# Altium project ExtPlate.PrjPCB
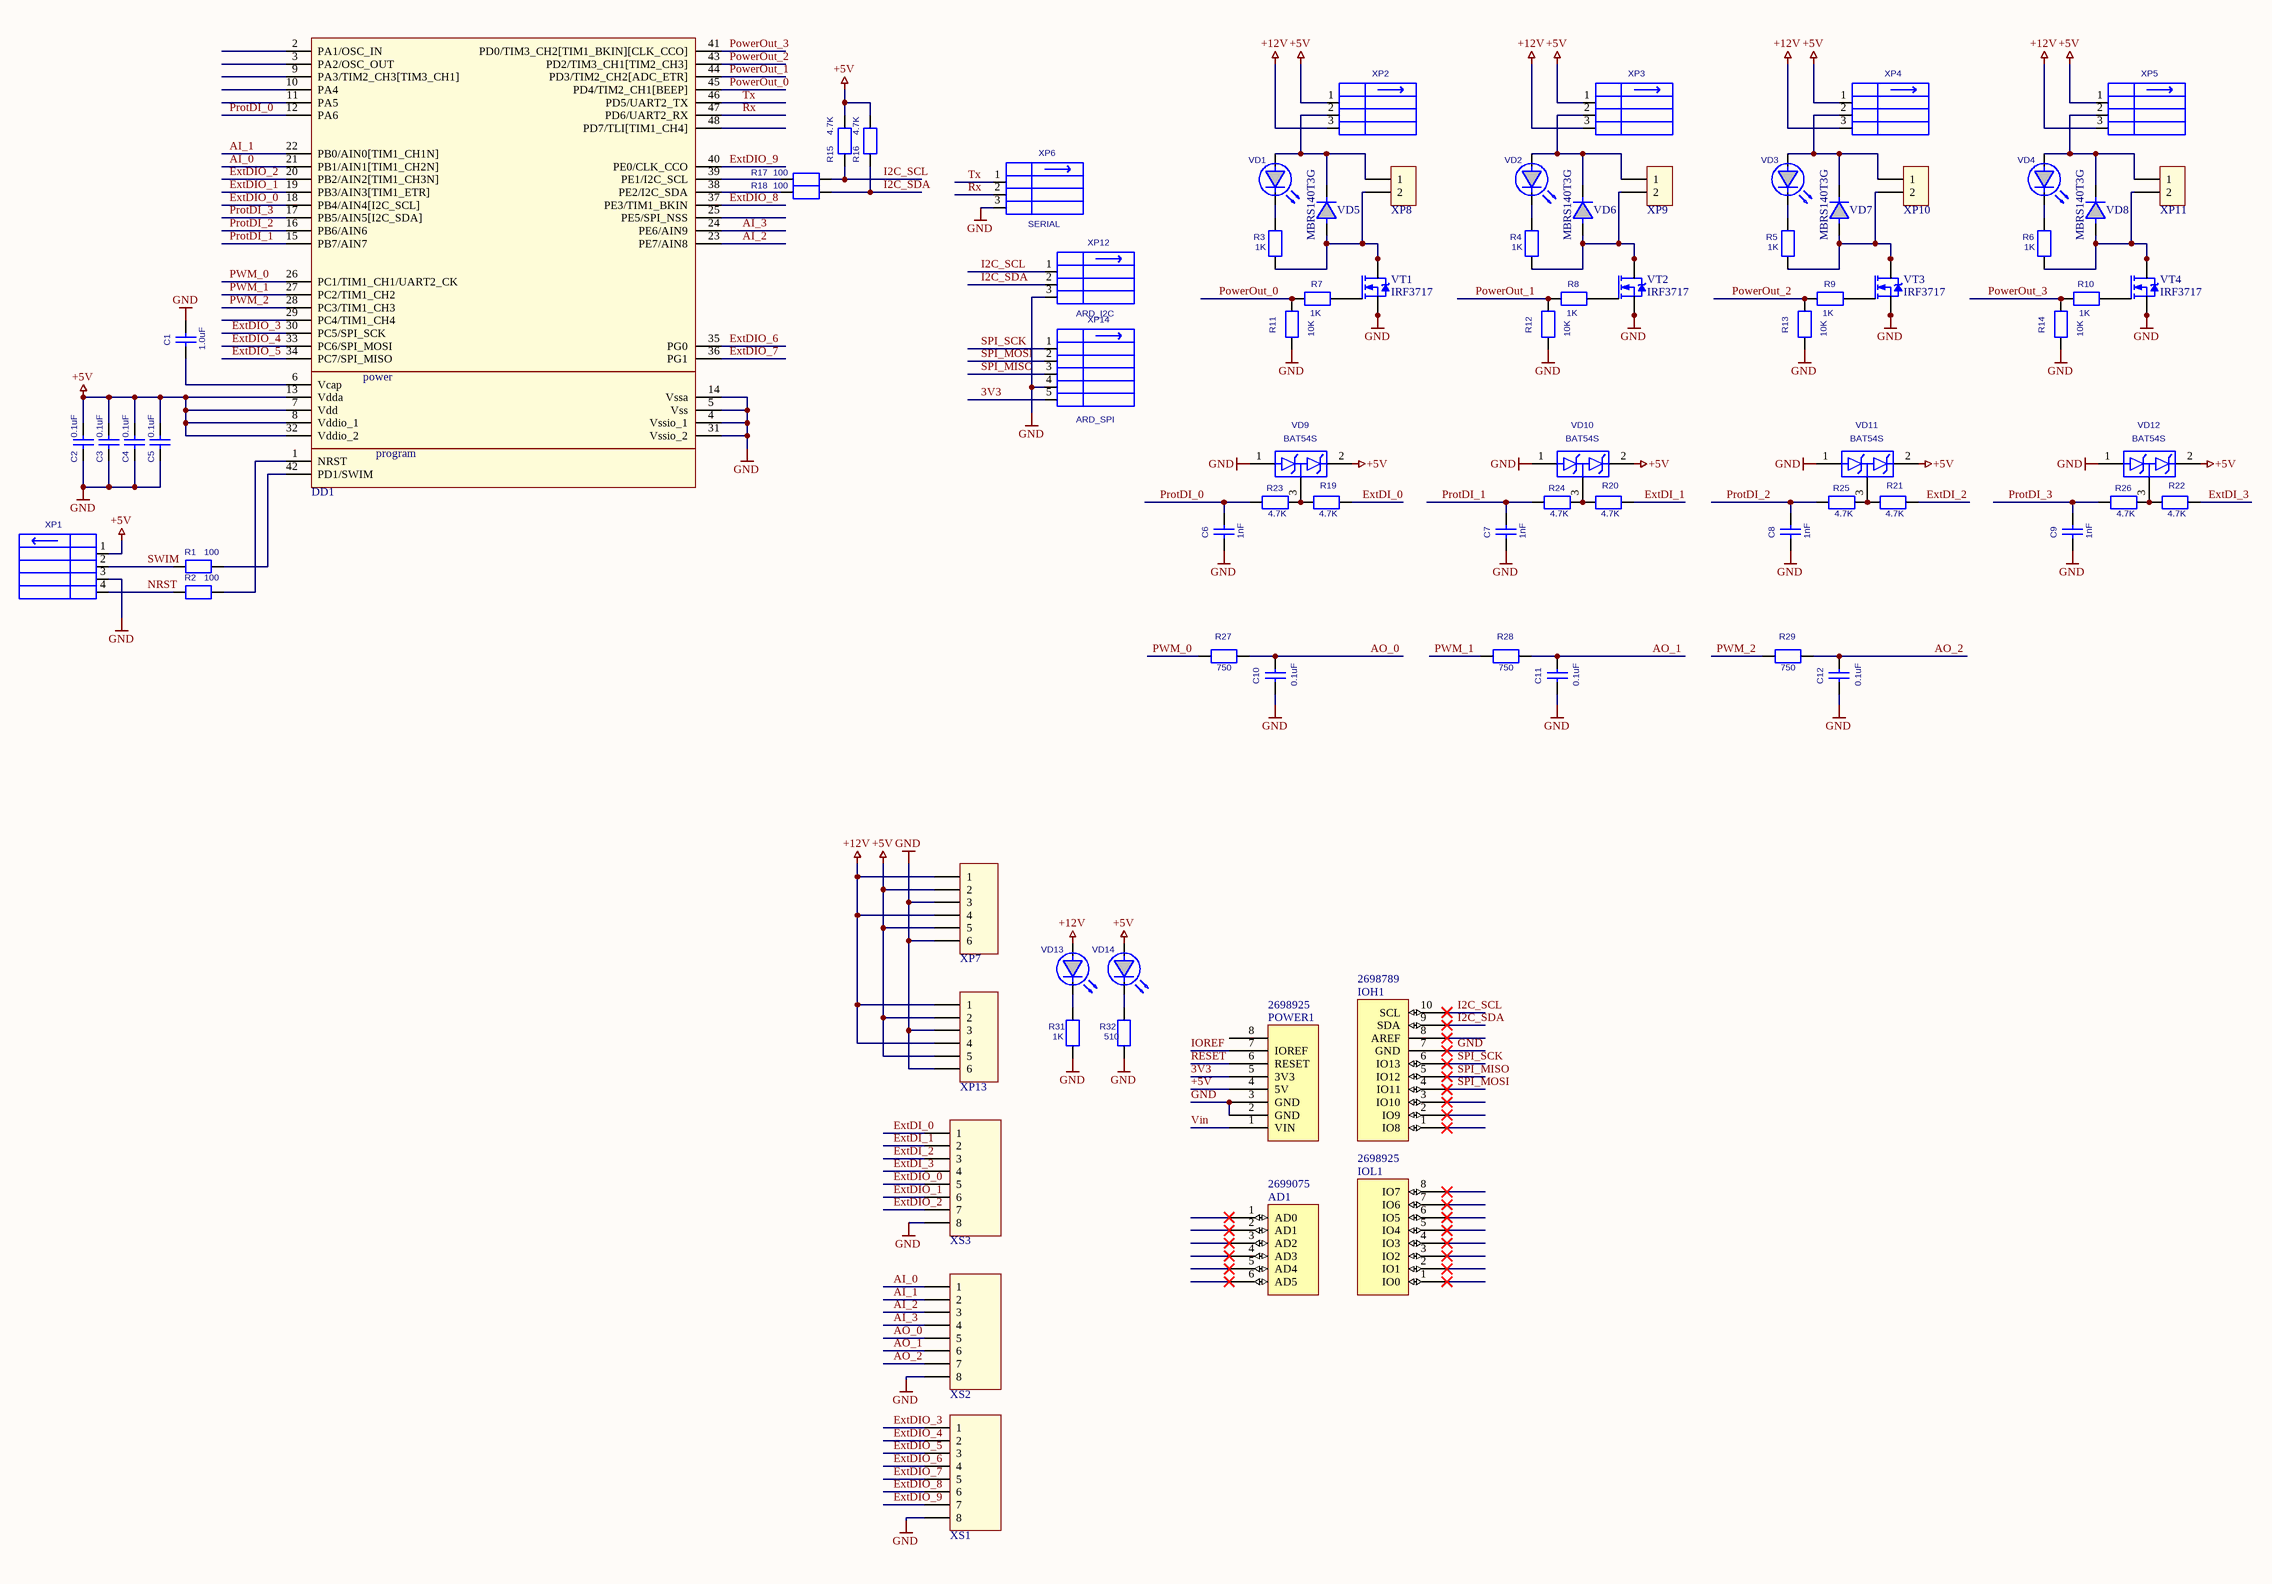
[diagram p0: ExtPlateSheet1.SchDoc]
1 sheet, 83 parts. Net scope: global (net labels, ports and power ports of the same name join across sheets).
Board file: ExtPlatePCB1.PcbDoc

## Sheet ExtPlateSheet1.SchDoc
size A2; Scale: {Масш.}; Title1str: {Наименование}; PageSetup: Record=PageOptions|CenterHorizontal=False|CenterVertical=False|PrintScale=0.95|XCorrection=0.00|YCorrection=0.00|PrintKind=1|BorderSize=5000000|LeftOffset=0|BottomOffset=0|Orientation=1|PaperLength=1000|PaperWidth=1000|Scale=100|PaperSource=15|PrintQuality=600|MediaType=1|DitherType=10|PaperKind=A4|PrintScaleMode=1; Title2str: {Наименование}; ProcessInspection: {Т.контр.}; Mass: {Масса}; NormInspection: {Н.контр.}; EngineerName: {Инженер}; Letter1Column: {}; Letter2Column: {}; Letter3Column: {}; DocumentType: {Документ}; DocumentType1str: {Документ}; DocumentType2str: {Документ}; Organization: Altium Limited; Address1: 3 Minna Close; Address2: Belrose; Address3: NSW 2085; Address4: Australia

### Parts
AD1  Supplier Part Number 4: 2699075  [PLS6]  (hidden comment: AD)
C1  1.0uF  [C-1608[0603]]
C2  0.1uF  [C-1608[0603]]
C3  0.1uF  [C-1608[0603]]
C4  0.1uF  [C-1608[0603]]
C5  0.1uF  [C-1608[0603]]
C6  1nF  [C-1608[0603]]
C7  1nF  [C-1608[0603]]
C8  1nF  [C-1608[0603]]
C9  1nF  [C-1608[0603]]
C10  0.1uF  [C-1608[0603]]
C11  0.1uF  [C-1608[0603]]
C12  0.1uF  [C-1608[0603]]
DD1  STM8S105Cx  [LQFP48_N]  (value not drawn)
IOH1  Supplier Part Number 3: 2698789  [PLS10]  (hidden comment: IOH)
IOL1  Supplier Part Number 4: 2698925  [PLS8]  (hidden comment: IOL)
POWER1  Supplier Part Number 4: 2698925  [PLS8]  (hidden comment: POWER_UNO)
R1  100  [R-1608[0603]]
R2  100  [R-1608[0603]]
R3  1K  [R-1608[0603]]
R4  1K  [R-1608[0603]]
R5  1K  [R-1608[0603]]
R6  1K  [R-1608[0603]]
R7  1K  [R-1608[0603]]
R8  1K  [R-1608[0603]]
R9  1K  [R-1608[0603]]
R10  1K  [R-1608[0603]]
R11  10K  [R-1608[0603]]
R12  10K  [R-1608[0603]]
R13  10K  [R-1608[0603]]
R14  10K  [R-1608[0603]]
R15  4.7K  [R-1608[0603]]
R16  4.7K  [R-1608[0603]]
R17  100  [R-1608[0603]]
R18  100  [R-1608[0603]]
R19  4.7K  [R-1608[0603]]
R20  4.7K  [R-1608[0603]]
R21  4.7K  [R-1608[0603]]
R22  4.7K  [R-1608[0603]]
R23  4.7K  [R-1608[0603]]
R24  4.7K  [R-1608[0603]]
R25  4.7K  [R-1608[0603]]
R26  4.7K  [R-1608[0603]]
R27  750  [R-1608[0603]]
R28  750  [R-1608[0603]]
R29  750  [R-1608[0603]]
R31  1K  [R-1608[0603]]
R32  510  [R-1608[0603]]
VD1  KB170G  [LED-2012[0805]]  (value not drawn)
VD2  KB170G  [LED-2012[0805]]  (value not drawn)
VD3  KB170G  [LED-2012[0805]]  (value not drawn)
VD4  KB170G  [LED-2012[0805]]  (value not drawn)
VD5  MBRS140T3G  [SMB]
VD6  MBRS140T3G  [SMB]
VD7  MBRS140T3G  [SMB]
VD8  MBRS140T3G  [SMB]
VD9  BAT54S  [SOT-23]
VD10  BAT54S  [SOT-23]
VD11  BAT54S  [SOT-23]
VD12  BAT54S  [SOT-23]
VD13  KB170G  [LED-2012[0805]]  (value not drawn)
VD14  KB170G  [LED-2012[0805]]  (value not drawn)
VT1  IRF3717  [SO8]
VT2  IRF3717  [SO8]
VT3  IRF3717  [SO8]
VT4  IRF3717  [SO8]
XP1  PLS-4  [PLS4]  (value not drawn)
XP2  PLS-3  [PLS3]  (value not drawn)
XP3  PLS-3  [PLS3]  (value not drawn)
XP4  PLS-3  [PLS3]  (value not drawn)
XP5  PLS-3  [PLS3]  (value not drawn)
XP6  value SERIAL  [PLS3]  (hidden comment: PLS-3)
XP7  MF-6M  [MF-6M]  (value not drawn)
XP8  2EDGR-5.08  [2EDGR-5.08]  (value not drawn)
XP9  2EDGR-5.08  [2EDGR-5.08]  (value not drawn)
XP10  2EDGR-5.08  [2EDGR-5.08]  (value not drawn)
XP11  2EDGR-5.08  [2EDGR-5.08]  (value not drawn)
XP12  value ARD_I2C  [PLS3]  (hidden comment: PLS-3)
XP13  MF-6M  [MF-6M]  (value not drawn)
XP14  value ARD_SPI  [PLS5]  (hidden comment: PLS-5)
XS1  5555164-1  [RJ45 8pin]  (value not drawn)
XS2  5555164-1  [RJ45 8pin]  (value not drawn)
XS3  5555164-1  [RJ45 8pin]  (value not drawn)

### Nets
+5V: C2.1 C3.1 C4.1 C5.1 DD1.7(Vdd) DD1.8(Vddio_1) DD1.13(Vdda) DD1.32(Vddio_2) POWER1.4(5V) R15.2 R16.2 VD9.2(c) VD10.2(c) VD11.2(c) VD12.2(c) VD14.2(A) XP1.1 XP2.1 XP3.1 XP4.1 XP5.1 XP7.2 XP7.5 XP13.2 XP13.5
+12V: VD13.2(A) XP2.3 XP3.3 XP4.3 XP5.3 XP7.1 XP7.4 XP13.1 XP13.4
GND: C1.1 C2.2 C3.2 C4.2 C5.2 C6.2 C7.2 C8.2 C9.2 C10.2 C11.2 C12.2 DD1.4(Vssio_1) DD1.5(Vss) DD1.14(Vssa) DD1.31(Vssio_2) IOH1.7(GND) POWER1.2(GND) POWER1.3(GND) R11.1 R12.1 R13.1 R14.1 R31.2 R32.2 VD9.1(a) VD10.1(a) VD11.1(a) VD12.1(a) VT1.1 VT1.2 VT1.3 VT2.1 VT2.2 VT2.3 VT3.1 VT3.2 VT3.3 VT4.1 VT4.2 VT4.3 XP1.3 XP6.3 XP7.3 XP7.6 XP12.3 XP13.3 XP13.6 XP14.4 XS1.8 XS2.8 XS3.8
3V3: POWER1.5(3V3) XP14.5
AI_0: DD1.21(PB1/AIN1[TIM1_CH2N]) XS2.1
AI_1: DD1.22(PB0/AIN0[TIM1_CH1N]) XS2.2
AI_2: DD1.23(PE7/AIN8) XS2.3
AI_3: DD1.24(PE6/AIN9) XS2.4
AO_0: C10.1 R27.2 XS2.5
AO_1: C11.1 R28.2 XS2.6
AO_2: C12.1 R29.2 XS2.7
ExtDI_0: R19.2 XS3.1
ExtDI_1: R20.2 XS3.2
ExtDI_2: R21.2 XS3.3
ExtDI_3: R22.2 XS3.4
ExtDIO_0: DD1.18(PB4/AIN4[I2C_SCL]) XS3.5
ExtDIO_1: DD1.19(PB3/AIN3[TIM1_ETR]) XS3.6
ExtDIO_2: DD1.20(PB2/AIN2[TIM1_CH3N]) XS3.7
ExtDIO_3: DD1.30(PC5/SPI_SCK) XS1.1
ExtDIO_4: DD1.33(PC6/SPI_MOSI) XS1.2
ExtDIO_5: DD1.34(PC7/SPI_MISO) XS1.3
ExtDIO_6: DD1.35(PG0) XS1.4
ExtDIO_7: DD1.36(PG1) XS1.5
ExtDIO_8: DD1.37(PE3/TIM1_BKIN) XS1.6
ExtDIO_9: DD1.40(PE0/CLK_CCO) XS1.7
I2C_SCL: IOH1.10(SCL) R15.1 R17.2 XP12.1
I2C_SDA: IOH1.9(SDA) R16.1 R18.2 XP12.2
IOREF: POWER1.7(IOREF)
NRST: R2.1 XP1.4
PowerOut_0: DD1.45(PD4/TIM2_CH1[BEEP]) R7.2 R11.2
PowerOut_1: DD1.44(PD3/TIM2_CH2[ADC_ETR]) R8.2 R12.2
PowerOut_2: DD1.43(PD2/TIM3_CH1[TIM2_CH3]) R9.2 R13.2
PowerOut_3: DD1.41(PD0/TIM3_CH2[TIM1_BKIN][CLK_CCO]) R10.2 R14.2
ProtDI_0: C6.1 DD1.12(PA6) R23.1
ProtDI_1: C7.1 DD1.15(PB7/AIN7) R24.1
ProtDI_2: C8.1 DD1.16(PB6/AIN6) R25.1
ProtDI_3: C9.1 DD1.17(PB5/AIN5[I2C_SDA]) R26.1
PWM_0: DD1.26(PC1/TIM1_CH1/UART2_CK) R27.1
PWM_1: DD1.27(PC2/TIM1_CH2) R28.1
PWM_2: DD1.28(PC3/TIM1_CH3) R29.1
RESET: POWER1.6(RESET)
Rx: DD1.47(PD6/UART2_RX) XP6.2
SPI_MISO: IOH1.5(IO12) XP14.3
SPI_MOSI: IOH1.4(IO11) XP14.2
SPI_SCK: IOH1.6(IO13) XP14.1
SWIM: R1.1 XP1.2
Tx: DD1.46(PD5/UART2_TX) XP6.1
Vin: POWER1.1(VIN)
NetC1_2: C1.2 DD1.6(Vcap)
NetDD1_1: DD1.1(NRST) R2.2
NetDD1_38: DD1.38(PE2/I2C_SDA) R18.1
NetDD1_39: DD1.39(PE1/I2C_SCL) R17.1
NetDD1_42: DD1.42(PD1/SWIM) R1.2
NetR3_1: R3.1 VD1.1(K)
NetR3_2: R3.2 VD5.2(A) VT1.5 VT1.6 VT1.7 VT1.8 XP8.2
NetR4_1: R4.1 VD2.1(K)
NetR4_2: R4.2 VD6.2(A) VT2.5 VT2.6 VT2.7 VT2.8 XP9.2
NetR5_1: R5.1 VD3.1(K)
NetR5_2: R5.2 VD7.2(A) VT3.5 VT3.6 VT3.7 VT3.8 XP10.2
NetR6_1: R6.1 VD4.1(K)
NetR6_2: R6.2 VD8.2(A) VT4.5 VT4.6 VT4.7 VT4.8 XP11.2
NetR7_1: R7.1 VT1.4
NetR8_1: R8.1 VT2.4
NetR9_1: R9.1 VT3.4
NetR10_1: R10.1 VT4.4
NetR19_1: R19.1 R23.2 VD9.3(ka)
NetR20_1: R20.1 R24.2 VD10.3(ka)
NetR21_1: R21.1 R25.2 VD11.3(ka)
NetR22_1: R22.1 R26.2 VD12.3(ka)
NetR31_1: R31.1 VD13.1(K)
NetR32_1: R32.1 VD14.1(K)
NetVD1_2: VD1.2(A) VD5.1(K) XP2.2 XP8.1
NetVD2_2: VD2.2(A) VD6.1(K) XP3.2 XP9.1
NetVD3_2: VD3.2(A) VD7.1(K) XP4.2 XP10.1
NetVD4_2: VD4.2(A) VD8.1(K) XP5.2 XP11.1

Not connected (* = marked no-connect by the designer): AD1 1(AD0)* 2(AD1)* 3(AD2)* 4(AD3)* 5(AD4)* 6(AD5)*; DD1 2(PA1/OSC_IN) 3(PA2/OSC_OUT) 9(PA3/TIM2_CH3[TIM3_CH1]) 10(PA4) 11(PA5) 25(PE5/SPI_NSS) 29(PC4/TIM1_CH4) 48(PD7/TLI[TIM1_CH4]); IOH1 1(IO8)* 2(IO9)* 3(IO10)* 8(AREF)*; IOL1 1(IO0)* 2(IO1)* 3(IO2)* 4(IO3)* 5(IO4)* 6(IO5)* 7(IO6)* 8(IO7)*; POWER1 8

### Notes on the sheet
- Title
- Size:
- Date:
- File:
- A0
- Number:
- Time:
- Revision:
- Sheet
- of
- (in symbol STM8S105C) power; program

### Library data of the parts
C1-C12 = C-0603: Value: *
DD1 = STM8S105C: Access line, 16 MHz STM8S 8-bit MCU
R1-R29 R31 R32 = R-0603: Value: *
VD1-VD4 VD13 VD14 = KB170G: Green Led 0805; Value: {Value}
VD5-VD8 = MBRS140T3G: Surface Mount Schottky Power Rectifier
VD9-VD12 = BAT54S: Schottky barrier (double) diodes
XP1 = PLS-4: Value: {Value}
XP2-XP5 = PLS-3: Value: {Value}
XP7 XP13 = MF-6M: Mini-Fit 6 pin Connector on board.
XS1-XS3 = 5555164-1: PCB Mounted Jacks - Single Port, Multi-port and Stacked
AD1 = AD: Supplier 1: Arrow; Supplier Part Number 1: 2699089; Supplier 2: Digi-Key; Supplier Part Number 2: SAM1198-06-ND; Supplier 3: Arrow; Supplier Part Number 3: 2699088; Supplier 4: Arrow
IOH1 = IOH: Supplier 1: Arrow; Supplier Part Number 1: 2698803S4475693N1004; Supplier 2: Digi-Key; Supplier Part Number 2: SAM1198-10-ND; Supplier 3: Arrow
IOL1 = IOL: Supplier 1: Digi-Key; Supplier Part Number 1: SAM1198-08-ND; Supplier 2: Arrow; Supplier Part Number 2: 2698939; Supplier 3: Arrow; Supplier Part Number 3: 2698940; Supplier 4: Arrow
POWER1 = POWER_UNO: Supplier 1: Digi-Key; Supplier Part Number 1: SAM1198-08-ND; Supplier 2: Arrow; Supplier Part Number 2: 2698939; Supplier 3: Arrow; Supplier Part Number 3: 2698940; Supplier 4: Arrow